# Altium project Mainboard.PrjPcb (part 1 of 2)
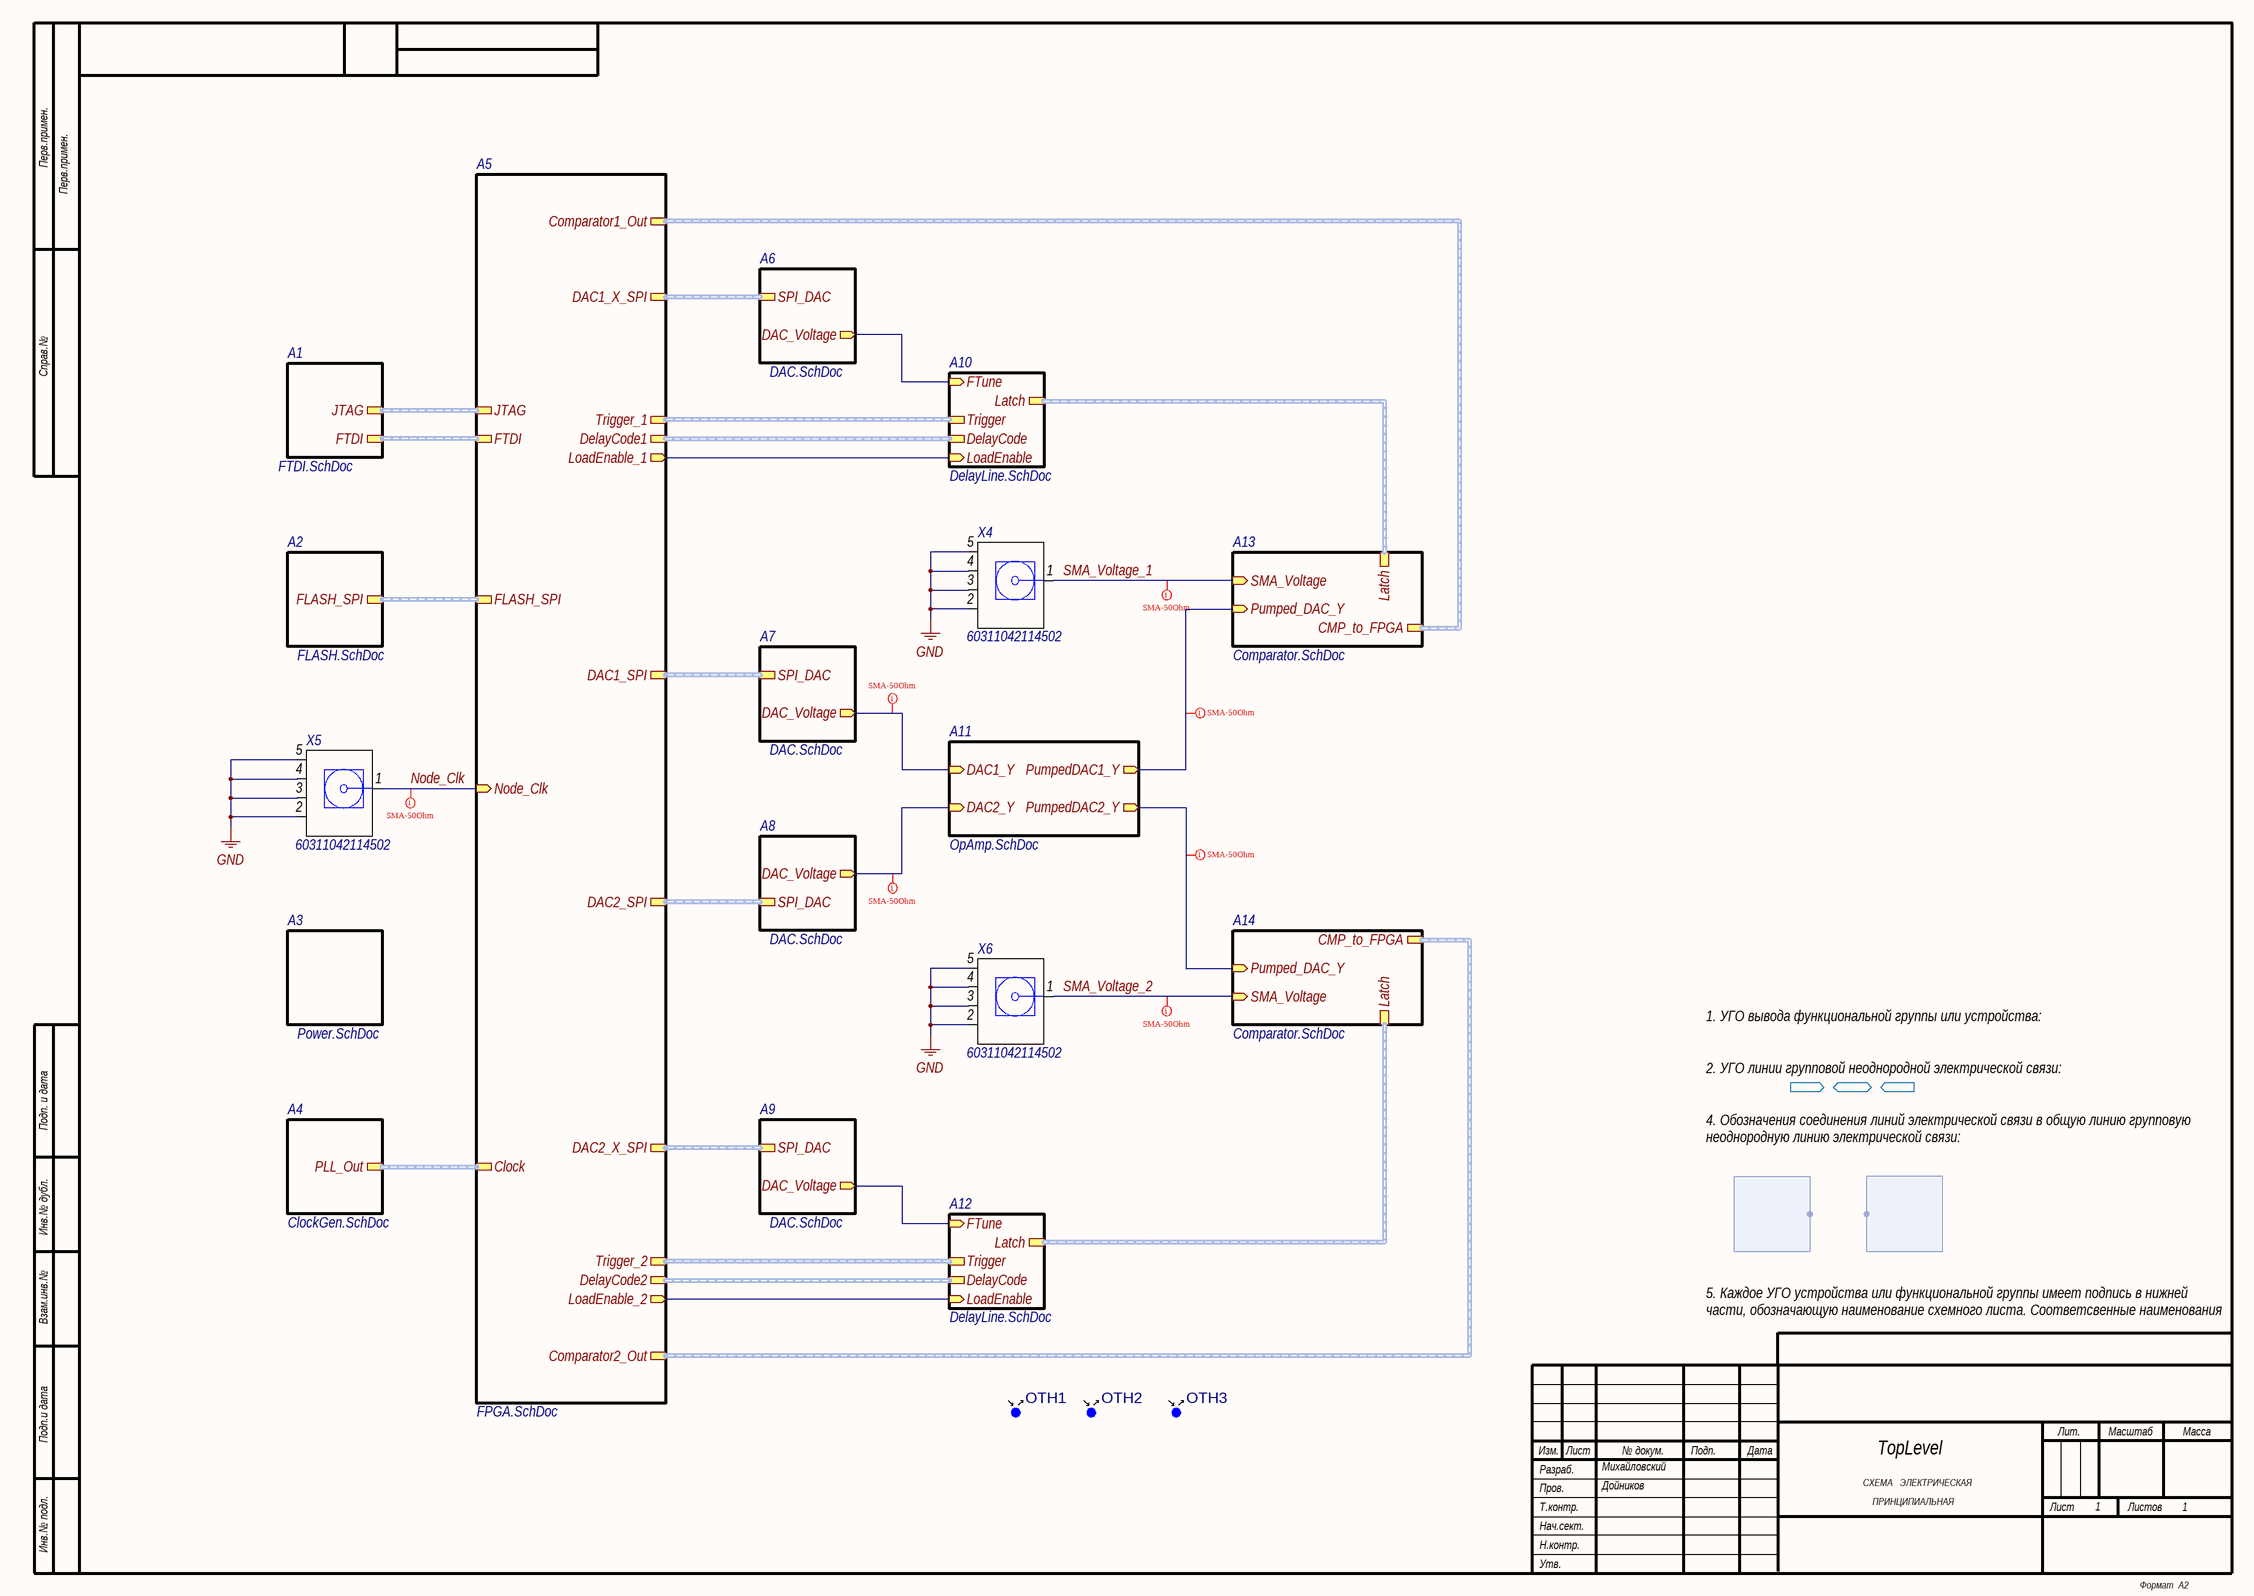
[diagram p0: TopLevel.SchDoc]
10 sheets, 208 parts. Net scope: hierarchical (ports join the sheet entries above them; power ports are global).
Board file: CalibratorPCB_v2.PcbDoc
Sheets:
  TopLevel.SchDoc
    A5 = FPGA.SchDoc
    A2 = FLASH.SchDoc
    A7 = DAC.SchDoc
    A1 = FTDI.SchDoc
    A3 = Power.SchDoc
    A13 = Comparator.SchDoc
    A10 = DelayLine.SchDoc
    A8 = DAC.SchDoc
    A12 = DelayLine.SchDoc
    A14 = Comparator.SchDoc
    A6 = DAC.SchDoc
    A9 = DAC.SchDoc
    A11 = OpAmp.SchDoc
    A4 = ClockGen.SchDoc

## Sheet TopLevel.SchDoc: Наименование
size 594 x 420 mm; CheckedBy: Дойников; Author: Михайловский; SheetNumber: 1; SheetTotal: 1; PageSetup: Record=PageOptions|CenterHorizontal=True|CenterVertical=True|PrintScale=0.94|XCorrection=1.00|YCorrection=1.00|PrintKind=1|BorderSize=5000000|LeftOffset=0|BottomOffset=0|Orientation=1|PaperLength=1000|PaperWidth=1000|Scale=100|PaperSource=7|PrintQuality=-4|MediaType=1|DitherType=10|PaperKind=A4|PrintScaleMode=1; MainDevice: Перв.примен.; Name: TopLevel; DocumentName: Sheet1.SCHDOC

### Parts
OTH1  REPER_D1.0MM  [REPER_D1.0MM]  (value not drawn)  (no BOM)
OTH2  REPER_D1.0MM  [REPER_D1.0MM]  (value not drawn)  (no BOM)
OTH3  REPER_D1.0MM  [REPER_D1.0MM]  (value not drawn)  (no BOM)
X4  (no value)  [60311042114502]
X5  (no value)  [60311042114502]
X6  (no value)  [60311042114502]

### Sub-sheets
A1 = FTDI.SchDoc: JTAG (harness JTAG), FTDI (harness FTDI_UART_SPI)
A2 = FLASH.SchDoc: FLASH_SPI (harness SPI)
A3 = Power.SchDoc: no entries
A4 = ClockGen.SchDoc: PLL_Out (harness Diff_Pair)
A5 = FPGA.SchDoc: JTAG (harness JTAG), FLASH_SPI (harness SPI), Trigger_1 (harness Signal), Trigger_2 (harness Signal), DAC2_SPI (harness SPI), DAC1_SPI (harness SPI), DelayCode1 (harness DelayCode), DelayCode2 (harness DelayCode), Comparator2_Out (harness Signal), Comparator1_Out (harness Signal), LoadEnable_2 (out), LoadEnable_1 (out), FTDI (harness FTDI_UART_SPI), DAC2_X_SPI (harness SPI), DAC1_X_SPI (harness SPI), Node_Clk (in), Clock (harness Diff_Pair)
A6 = DAC.SchDoc: SPI_DAC (harness SPI), DAC_Voltage (out)
A7 = DAC.SchDoc: SPI_DAC (harness SPI), DAC_Voltage (out)
A8 = DAC.SchDoc: SPI_DAC (harness SPI), DAC_Voltage (out)
A9 = DAC.SchDoc: SPI_DAC (harness SPI), DAC_Voltage (out)
A10 = DelayLine.SchDoc: Trigger (harness Signal), Latch (harness Signal), DelayCode (harness DelayCode), LoadEnable (in), FTune (in)
A11 = OpAmp.SchDoc: PumpedDAC2_Y (out), DAC1_Y (in), DAC2_Y (in), PumpedDAC1_Y (out)
A12 = DelayLine.SchDoc: Trigger (harness Signal), Latch (harness Signal), DelayCode (harness DelayCode), LoadEnable (in), FTune (in)
A13 = Comparator.SchDoc: Latch (harness Signal), CMP_to_FPGA (harness Signal), Pumped_DAC_Y (in), SMA_Voltage (in)
A14 = Comparator.SchDoc: Latch (harness Signal), CMP_to_FPGA (harness Signal), Pumped_DAC_Y (in), SMA_Voltage (in)

### Harnesses
*: 

### Nets
GND: X4.2(GND) X4.3(GND) X4.4(GND) X4.5(GND) X5.2(GND) X5.3(GND) X5.4(GND) X5.5(GND) X6.2(GND) X6.3(GND) X6.4(GND) X6.5(GND)
Enable_1: sheet A5/LoadEnable_1, sheet A10/LoadEnable
Enable_2: sheet A5/LoadEnable_2, sheet A12/LoadEnable
Node_Clk: X5.1(Signal) ; sheet A5/Node_Clk
SMA_Voltage_1: X4.1(Signal) ; sheet A13/SMA_Voltage
SMA_Voltage_2: X6.1(Signal) ; sheet A14/SMA_Voltage
NetA6.DA4_3: sheet A10/FTune, sheet A6/DAC_Voltage
NetA7.DA4_3: sheet A7/DAC_Voltage, sheet A11/DAC1_Y
NetA8.DA4_3: sheet A8/DAC_Voltage, sheet A11/DAC2_Y
NetA9.DA4_3: sheet A12/FTune, sheet A9/DAC_Voltage
NetA13.C55_1: sheet A13/Pumped_DAC_Y, sheet A11/PumpedDAC1_Y
NetA14.C55_1: sheet A14/Pumped_DAC_Y, sheet A11/PumpedDAC2_Y

### Buses and harness runs
harness sheet A1/FTDI = sheet A5/FTDI
harness sheet A1/JTAG = sheet A5/JTAG
harness sheet A2/FLASH_SPI = sheet A5/FLASH_SPI
harness sheet A4/PLL_Out = sheet A5/Clock
harness sheet A5/Comparator1_Out = sheet A13/CMP_to_FPGA
harness sheet A5/Comparator2_Out = sheet A14/CMP_to_FPGA
harness sheet A5/DAC1_SPI = sheet A7/SPI_DAC
harness sheet A5/DAC1_X_SPI = sheet A6/SPI_DAC
harness sheet A5/DAC2_SPI = sheet A8/SPI_DAC
harness sheet A5/DAC2_X_SPI = sheet A9/SPI_DAC
harness sheet A5/DelayCode1 = sheet A10/DelayCode
harness sheet A5/DelayCode2 = sheet A12/DelayCode
harness sheet A5/Trigger_1 = sheet A10/Trigger
harness sheet A5/Trigger_2 = sheet A12/Trigger
harness sheet A10/Latch = sheet A13/Latch
harness sheet A12/Latch = sheet A14/Latch

### Layout directives
net class Channel_SMA: NetA7.DA4_3, NetA8.DA4_3, NetA13.C55_1, NetA14.C55_1, Node_Clk, SMA_Voltage_1, SMA_Voltage_2

### Notes on the sheet
- 1. УГО вывода функциональной группы или устройства:
  2. УГО линии групповой неоднородной электрической связи:
  4. Обозначения соединения линий электрической связи в общую линию групповую неоднородную линию электрической связи:
  5. Каждое УГО устройства или функциональной группы имеет подпись в нижней части, обозначающую наименование схемного листа. Соответсвенные наименования схемных листов приведены на нижнем поле каждого листа.
  6. УГО экземпляров функциональных групп выполнены сплошной линией.
- Перв.примен.
- Справ.№
- Подп. и дата
- Инв.№ дубл.
- Взам.инв.№
- Подп.и дата
- Разраб.
- Изм.
- Лист
- № докум.
- Подп.
- Дата
- Лит.
- Масштаб
- Масса
- Т.контр.
- Пров.
- ПРИНЦИПИАЛЬНАЯ
- СХЕМА   ЭЛЕКТРИЧЕСКАЯ
- Листов
- Инв.№ подл.
- Утв.
- Н.контр.
- Нач.сект.
- Формат  A2

### Library data of the parts
OTH1-OTH3 = REPER_D1.0MM: MntType: SMD; MSL: MSL 1; RoHS: Comply; BOMDescription: SMD; CFootprint: =Footprint; PART NUMBER: REPER_D1.0MM; CLASSNAME: Reper; COMPONENTLINK1DESCRIPTION: Datasheet; BOMDESCRIPTIONRUS: =PartTypeRUS+' '+MPN
X4-X6 = SMA_WR_60311042114502: MANUFACTURER: WE; MNTTYPE: SMD; PART NUMBER: SMA_WR_60311042114502; MPN: 60311042114502; MSL: MSL 1; ROHS: Comply; PARTTYPE: SMA; PINS: 5; BOMDESCRIPTION: =MntType+' '+PartType+' '+Package+' '+Value+' '+Tolerance+' '+Voltage+' '+TempCoeff+' '+MPN; CFOOTPRINT: =Footprint; CLASSNAME: SMA; COMPONENTLINK1DESCRIPTION: Datasheet; COMPONENTLINK1URL: https://katalog.we-online.de/em/datasheet/60311042114502.pdf

## Sheet FPGA.SchDoc: Наименование
size 594 x 420 mm; Name1: мониторинга климатических; Name2: параметров СХД; ApprovedBy: Утвердил; CheckedBy: Проверил; Author: Разработал; CompanyName: Организация; DrawnBy: Н.Контр; Engineer: Т.Контр; SheetNumber: 1; SheetTotal: 1; PageSetup: Record=PageOptions|CenterHorizontal=True|CenterVertical=True|PrintScale=0.94|XCorrection=1.00|YCorrection=1.00|PrintKind=1|BorderSize=5000000|LeftOffset=0|BottomOffset=0|Orientation=1|PaperLength=1000|PaperWidth=1000|Scale=100|PaperSource=7|PrintQuality=-4|MediaType=1|DitherType=10|PaperKind=A4|PrintScaleMode=1; DecimalNumber: FPGA; HeadOfSector: Нач. сектора; MainDevice: Перв.примен.; Name: Наименование; DocumentName: Sheet1.SCHDOC
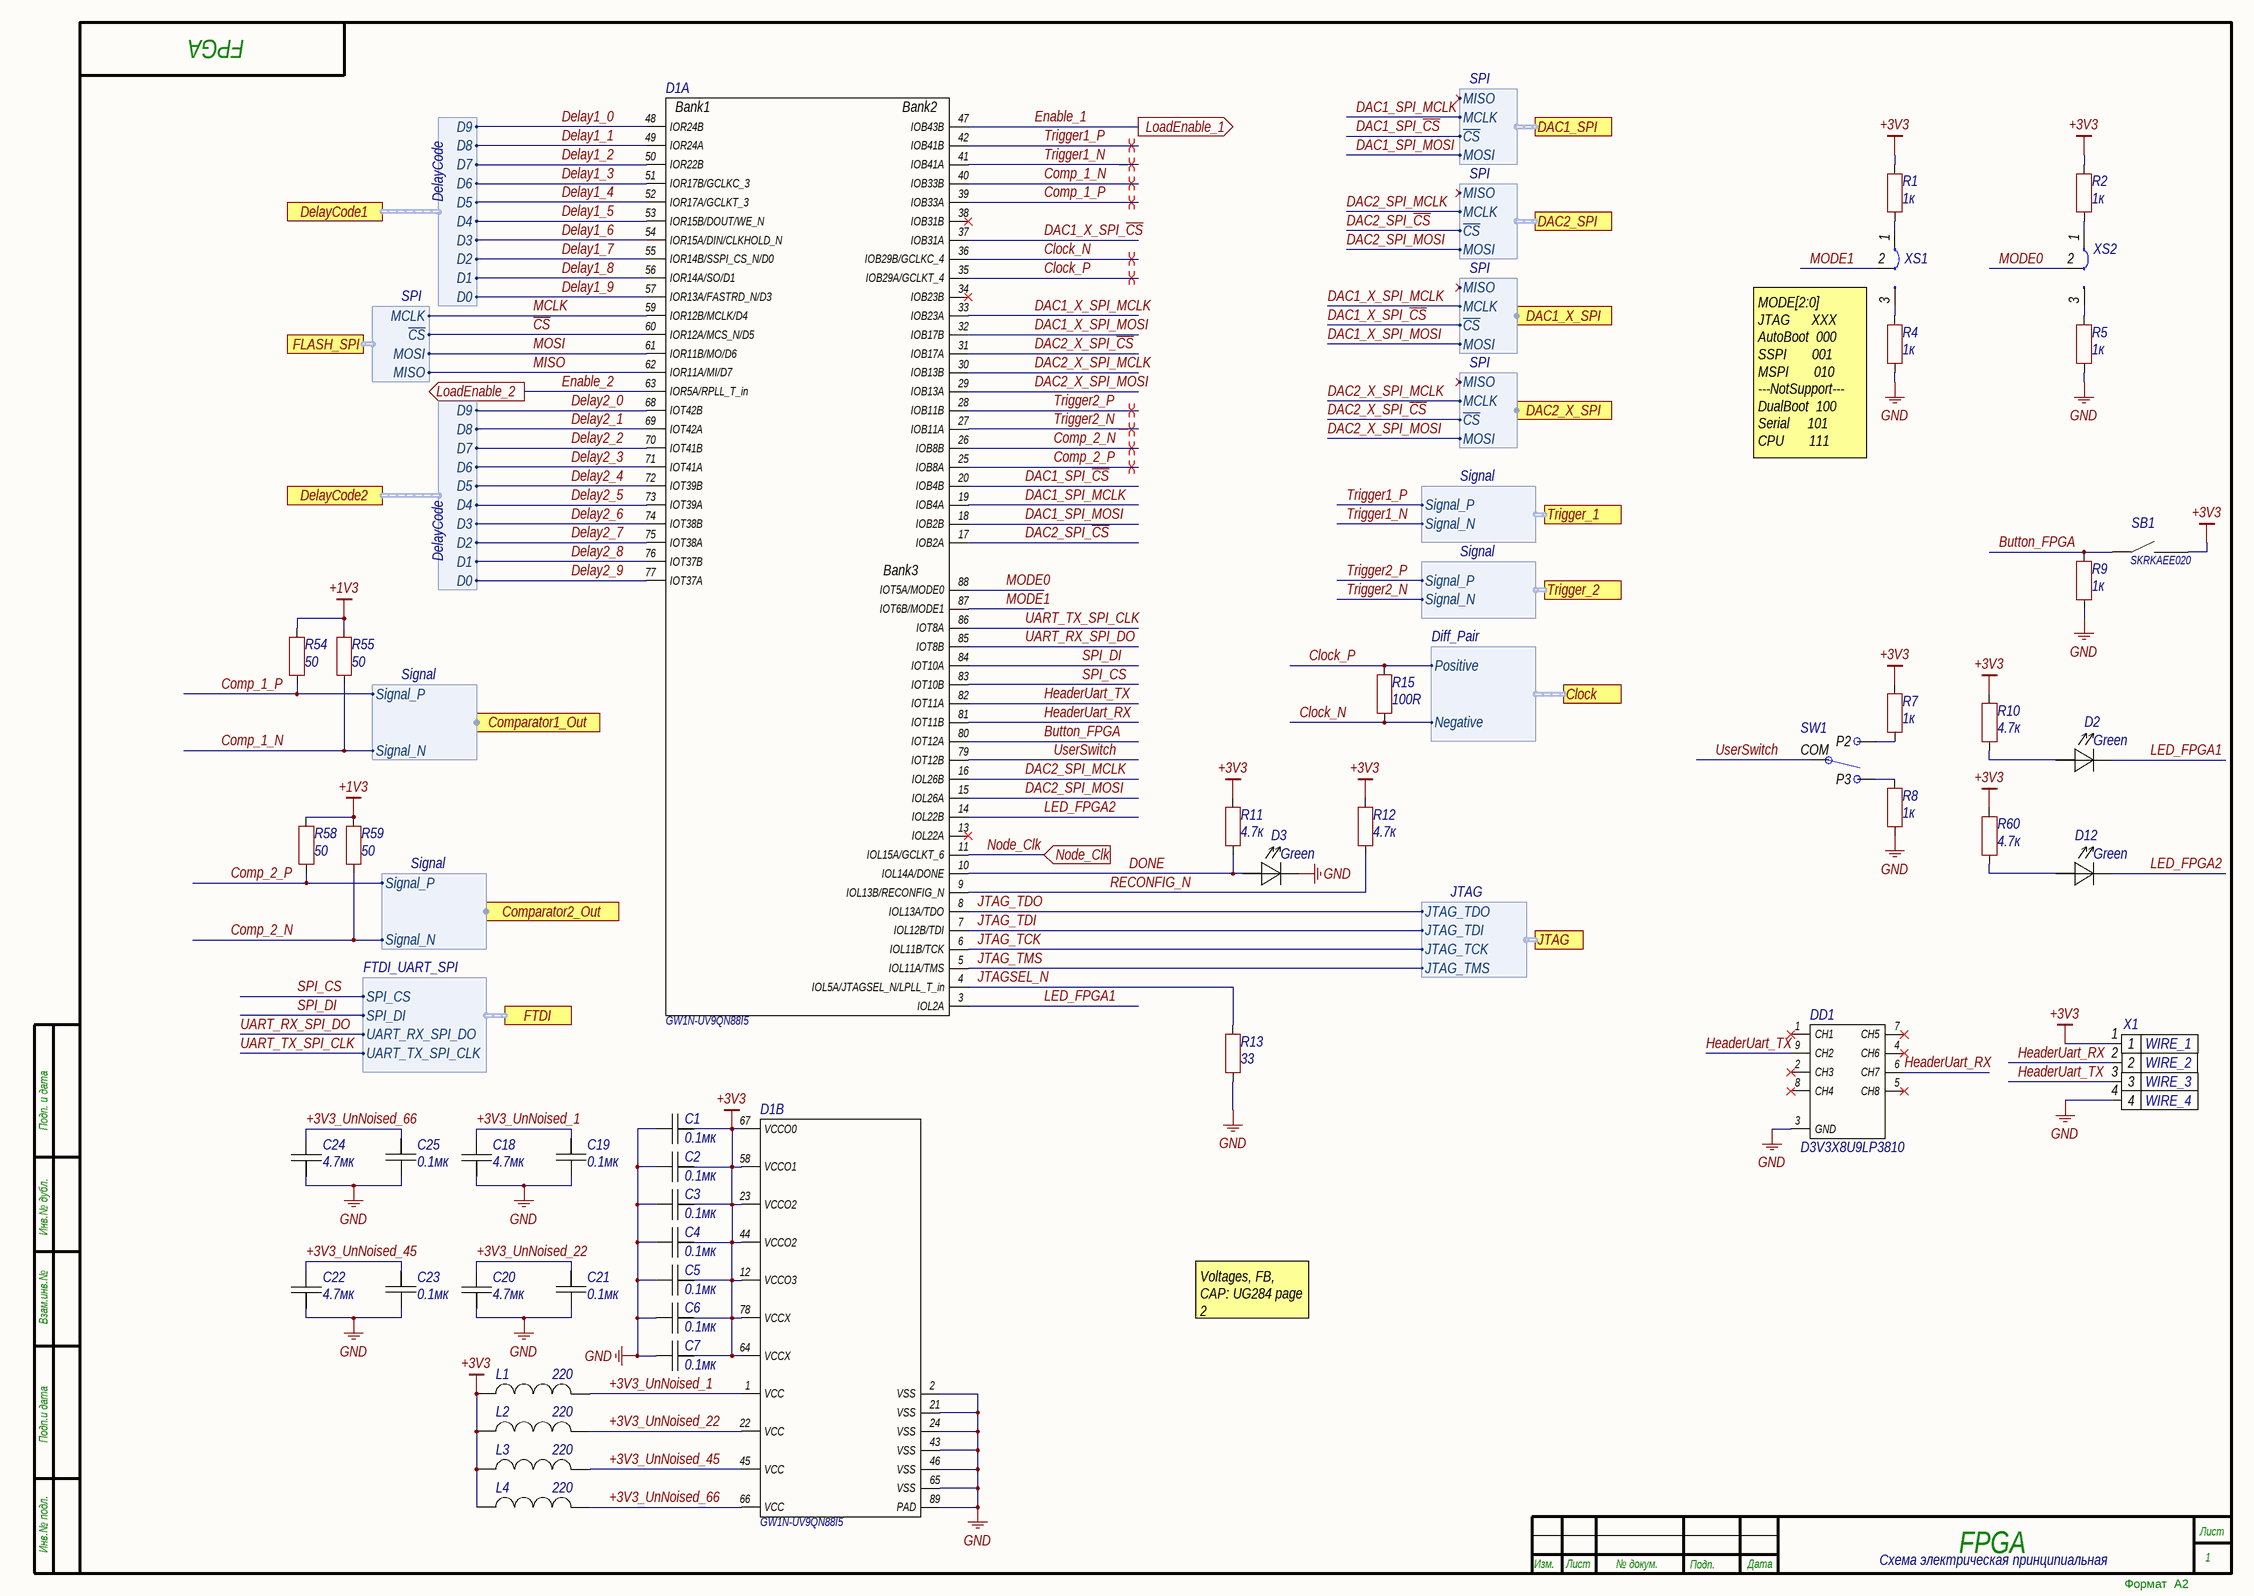
[diagram p1: FPGA.SchDoc]

### Parts
C1  value 0.1мк  [CAP0402]  (hidden comment: 0.1мк 50V)
C2  value 0.1мк  [CAP0402]  (hidden comment: 0.1мк 50V)
C3  value 0.1мк  [CAP0402]  (hidden comment: 0.1мк 50V)
C4  value 0.1мк  [CAP0402]  (hidden comment: 0.1мк 50V)
C5  value 0.1мк  [CAP0402]  (hidden comment: 0.1мк 50V)
C6  value 0.1мк  [CAP0402]  (hidden comment: 0.1мк 50V)
C7  value 0.1мк  [CAP0402]  (hidden comment: 0.1мк 50V)
C18  value 4.7мк  [CAP0402]  (hidden comment: 4.7мк 10V)
C19  value 0.1мк  [CAP0402]  (hidden comment: 0.1мк 50V)
C20  value 4.7мк  [CAP0402]  (hidden comment: 4.7мк 10V)
C21  value 0.1мк  [CAP0402]  (hidden comment: 0.1мк 50V)
C22  value 4.7мк  [CAP0402]  (hidden comment: 4.7мк 10V)
C23  value 0.1мк  [CAP0402]  (hidden comment: 0.1мк 50V)
C24  value 4.7мк  [CAP0402]  (hidden comment: 4.7мк 10V)
C25  value 0.1мк  [CAP0402]  (hidden comment: 0.1мк 50V)
D1  MPN: GW1N-UV9QN88I5  [QFN88_0.4pitch]  (parts A,B of 2)
D2  Green  [LED603]
D3  Green  [LED603]
D12  Green  [LED603]
DD1  MPN: D3V3X8U9LP3810  [U-DFN3810-9]  (hidden comment: TVS Diode at JTAG)
L1  220  [CAPC0603N]
L2  220  [CAPC0603N]
L3  220  [CAPC0603N]
L4  220  [CAPC0603N]
R1  value 1к  [RESC0402(1005)_M]  (hidden comment: 1к 1/16W)
R2  value 1к  [RESC0402(1005)_M]  (hidden comment: 1к 1/16W)
R4  value 1к  [RESC0402(1005)_M]  (hidden comment: 1к 1/16W)
R5  value 1к  [RESC0402(1005)_M]  (hidden comment: 1к 1/16W)
R7  value 1к  [RESC0402(1005)_M]  (hidden comment: 1к 1/16W)
R8  value 1к  [RESC0402(1005)_M]  (hidden comment: 1к 1/16W)
R9  1к  [RESC0402(1005)_M]
R10  4.7к  [RESC0402(1005)_M]
R11  4.7к  [RESC0402(1005)_M]
R12  4.7к  [RESC0402(1005)_M]
R13  value 33  [RESC0402(1005)_M]  (hidden comment: 33 1/16W)
R15  100R  [RESC0402(1005)_M]
R54  50  [RESC0402(1005)_M]
R55  50  [RESC0402(1005)_M]
R58  50  [RESC0402(1005)_M]
R59  50  [RESC0402(1005)_M]
R60  4.7к  [RESC0402(1005)_M]
SB1  MPN: SKRKAEE020  [SW_SKRKAEE020]  (hidden comment: DTSM-3)
SW1  Slide Switch  [KLS7-SS03-12D02-EG-3.0]  (value not drawn)
X1  Wire1: WIRE_1  Wire2: WIRE_2  Wire3: WIRE_3  Wire4: WIRE_4  [PLS4]  (hidden comment: PLS4)
XS1  PLS3  [PLS3]  (value not drawn)  (no BOM)
XS2  PLS3  [PLS3]  (value not drawn)  (no BOM)

### Ports
Clock (harness Diff_Pair), Comparator1_Out (harness Signal), Comparator2_Out (harness Signal), DAC1_SPI (harness SPI), DAC1_X_SPI (harness SPI), DAC2_SPI (harness SPI), DAC2_X_SPI (harness SPI), DelayCode1 (harness DelayCode), DelayCode2 (harness DelayCode), FLASH_SPI (harness SPI), FTDI (harness FTDI_UART_SPI), JTAG (harness JTAG), LoadEnable_1 (out), LoadEnable_2 (out), Node_Clk (in), Trigger_1 (harness Signal), Trigger_2 (harness Signal)

### Harnesses
JTAG: JTAG_TCK, JTAG_TDI, JTAG_TDO, JTAG_TMS
SPI: ~{CS}, MCLK, MISO, MOSI
Signal: Signal_P, Signal_N
DelayCode: D0, D1, D2, D3, D4, D5, D6, D7, D8, D9
FTDI_UART_SPI: SPI_CS, SPI_DI, UART_RX_SPI_DO, UART_TX_SPI_CLK
Diff_Pair: Positive, Negative

### Nets
+1V3: R54.2 R55.2 R58.2 R59.2
+3V3: C1.1 C2.1 C3.1 C4.1 C5.1 C6.1 C7.1 D1.12(VCCO3) D1.23(VCCO2) D1.44(VCCO2) D1.58(VCCO1) D1.64(VCCX) D1.67(VCCO0) D1.78(VCCX) L1.1 L2.1 L3.1 L4.1 R1.2 R2.2 R7.2 R10.2 R11.2 R12.2 R60.2 SB1.1 X1.1
GND: C1.2 C2.2 C3.2 C4.2 C5.2 C6.2 C7.2 C18.1 C19.2 C20.1 C21.2 C22.1 C23.2 C24.1 C25.2 D1.2(VSS) D1.21(VSS) D1.24(VSS) D1.43(VSS) D1.46(VSS) D1.65(VSS) D1.89(PAD) D3.1(A) DD1.3(GND) R4.1 R5.1 R8.1 R9.1 R13.1 X1.4
+3V3_UnNoised_1: C18.2 C19.1 D1.1(VCC) L1.2
+3V3_UnNoised_22: C20.2 C21.1 D1.22(VCC) L2.2
+3V3_UnNoised_45: C22.2 C23.1 D1.45(VCC) L3.2
+3V3_UnNoised_66: C24.2 C25.1 D1.66(VCC) L4.2
~{CS}: D1.60(IOR12A/MCS_N/D5) ; port FLASH_SPI.~{CS}
Button_FPGA: D1.80(IOT12A) R9.2 SB1.2
Clock_N: D1.36(IOB29B/GCLKC_4) R15.1 ; port Clock.Negative
Clock_P: D1.35(IOB29A/GCLKT_4) R15.2 ; port Clock.Positive
Comp_1_N: D1.40(IOB33B) R55.1 ; port Comparator1_Out.Signal_N
Comp_1_P: D1.39(IOB33A) R54.1 ; port Comparator1_Out.Signal_P
Comp_2_N: D1.26(IOB8B) R59.1 ; port Comparator2_Out.Signal_N
Comp_2_P: D1.25(IOB8A) R58.1 ; port Comparator2_Out.Signal_P
DAC1_SPI_~{CS}: D1.20(IOB4B) ; port DAC1_SPI.~{CS}
DAC1_SPI_MCLK: D1.19(IOB4A) ; port DAC1_SPI.MCLK
DAC1_SPI_MOSI: D1.18(IOB2B) ; port DAC1_SPI.MOSI
DAC1_X_SPI_~{CS}: D1.37(IOB31A) ; port DAC1_X_SPI.~{CS}
DAC1_X_SPI_MCLK: D1.33(IOB23A) ; port DAC1_X_SPI.MCLK
DAC1_X_SPI_MOSI: D1.32(IOB17B) ; port DAC1_X_SPI.MOSI
DAC2_SPI_~{CS}: D1.17(IOB2A) ; port DAC2_SPI.~{CS}
DAC2_SPI_MCLK: D1.16(IOL26B) ; port DAC2_SPI.MCLK
DAC2_SPI_MOSI: D1.15(IOL26A) ; port DAC2_SPI.MOSI
DAC2_X_SPI_~{CS}: D1.31(IOB17A) ; port DAC2_X_SPI.~{CS}
DAC2_X_SPI_MCLK: D1.30(IOB13B) ; port DAC2_X_SPI.MCLK
DAC2_X_SPI_MOSI: D1.29(IOB13A) ; port DAC2_X_SPI.MOSI
Delay1_0: D1.48(IOR24B) ; port DelayCode1.D9
Delay1_1: D1.49(IOR24A) ; port DelayCode1.D8
Delay1_2: D1.50(IOR22B) ; port DelayCode1.D7
Delay1_3: D1.51(IOR17B/GCLKC_3) ; port DelayCode1.D6
Delay1_4: D1.52(IOR17A/GCLKT_3) ; port DelayCode1.D5
Delay1_5: D1.53(IOR15B/DOUT/WE_N) ; port DelayCode1.D4
Delay1_6: D1.54(IOR15A/DIN/CLKHOLD_N) ; port DelayCode1.D3
Delay1_7: D1.55(IOR14B/SSPI_CS_N/D0) ; port DelayCode1.D2
Delay1_8: D1.56(IOR14A/SO/D1) ; port DelayCode1.D1
Delay1_9: D1.57(IOR13A/FASTRD_N/D3) ; port DelayCode1.D0
Delay2_0: D1.68(IOT42B) ; port DelayCode2.D9
Delay2_1: D1.69(IOT42A) ; port DelayCode2.D8
Delay2_2: D1.70(IOT41B) ; port DelayCode2.D7
Delay2_3: D1.71(IOT41A) ; port DelayCode2.D6
Delay2_4: D1.72(IOT39B) ; port DelayCode2.D5
Delay2_5: D1.73(IOT39A) ; port DelayCode2.D4
Delay2_6: D1.74(IOT38B) ; port DelayCode2.D3
Delay2_7: D1.75(IOT38A) ; port DelayCode2.D2
Delay2_8: D1.76(IOT37B) ; port DelayCode2.D1
Delay2_9: D1.77(IOT37A) ; port DelayCode2.D0
DONE: D1.10(IOL14A/DONE) D3.2(K) R11.1
Enable_1: D1.47(IOB43B) ; port LoadEnable_1
Enable_2: D1.63(IOR5A/RPLL_T_in) ; port LoadEnable_2
HeaderUart_RX: D1.81(IOT11B) DD1.6(CH7) X1.2
HeaderUart_TX: D1.82(IOT11A) DD1.9(CH2) X1.3
JTAG_TCK: D1.6(IOL11B/TCK) ; port JTAG.JTAG_TCK
JTAG_TDI: D1.7(IOL12B/TDI) ; port JTAG.JTAG_TDI
JTAG_TDO: D1.8(IOL13A/TDO) ; port JTAG.JTAG_TDO
JTAG_TMS: D1.5(IOL11A/TMS) ; port JTAG.JTAG_TMS
JTAGSEL_N: D1.4(IOL5A/JTAGSEL_N/LPLL_T_in) R13.2
LED_FPGA1: D1.3(IOL2A) D2.1(A)
LED_FPGA2: D1.14(IOL22B) D12.1(A)
MCLK: D1.59(IOR12B/MCLK/D4) ; port FLASH_SPI.MCLK
MISO: D1.62(IOR11A/MI/D7) ; port FLASH_SPI.MISO
MODE0: D1.88(IOT5A/MODE0) XS2.2
MODE1: D1.87(IOT6B/MODE1) XS1.2
MOSI: D1.61(IOR11B/MO/D6) ; port FLASH_SPI.MOSI
Node_Clk: D1.11(IOL15A/GCLKT_6) ; port Node_Clk
RECONFIG_N: D1.9(IOL13B/RECONFIG_N) R12.1
SPI_CS: D1.83(IOT10B) ; port FTDI.SPI_CS
SPI_DI: D1.84(IOT10A) ; port FTDI.SPI_DI
Trigger1_N: D1.41(IOB41A) ; port Trigger_1.Signal_N
Trigger1_P: D1.42(IOB41B) ; port Trigger_1.Signal_P
Trigger2_N: D1.27(IOB11A) ; port Trigger_2.Signal_N
Trigger2_P: D1.28(IOB11B) ; port Trigger_2.Signal_P
UART_RX_SPI_DO: D1.85(IOT8B) ; port FTDI.UART_RX_SPI_DO
UART_TX_SPI_CLK: D1.86(IOT8A) ; port FTDI.UART_TX_SPI_CLK
UserSwitch: D1.79(IOT12B) SW1.2(COM)
NetD2_2: D2.2(K) R10.1
NetD12_2: D12.2(K) R60.1
NetR1_1: R1.1 XS1.1
NetR2_1: R2.1 XS2.1
NetR4_2: R4.2 XS1.3
NetR5_2: R5.2 XS2.3
NetR7_1: R7.1 SW1.1(P2)
NetR8_2: R8.2 SW1.3(P3)

Not connected (* = marked no-connect by the designer): D1 13(IOL22A)* 34(IOB23B)* 38(IOB31B)*; DD1 1(CH1)* 2(CH3)* 4(CH6)* 5(CH8)* 7(CH5)* 8(CH4)*

### Layout directives
differential pair; differential pair class LVDS/PECL: Clock_N, Clock_P, Comp_1_N, Comp_1_P, Comp_2_N, Comp_2_P, Trigger1_N, Trigger1_P, Trigger2_N, Trigger2_P

### Notes on the sheet
- MODE[2:0]
  JTAG      XXX
  AutoBoot  000
  SSPI       001
  MSPI       010
  ---NotSupport---
  DualBoot  100
  Serial     101
  CPU       111
- Voltages, FB, CAP: UG284 page 2
- Схема электрическая принципиальная
- Подп. и дата
- Инв.№ дубл.
- Взам.инв.№
- Подп.и дата
- Инв.№ подл.
- Изм.
- Лист
- № докум.
- Подп.
- Дата
- Формат  A2
- (in symbol GW1N-UV9QN88I5, part A) Bank1; Bank2; Bank3

### Library data of the parts
C1-C7 C19 C21 C23 C25 = CAP0402: Manufacturer: Samsung Electro-Mechanics; ManufacturerAlt: JLCPCB; MPN: CL05B104KB54PNC; MPNAlt: C307331; MntType: SMD; Notes: Basic Part; Tolerance: 10%; Height: 0.5mm; MSL: MSL 1; Package: =Footprint; RoHS: Comply; Weight: 1.500mg; PartType: CHIP CERAMIC CAPACITOR; Pins: 2; BOMDescription: =MntType+' '+PartType+' '+Package+' '+Value+' '+Tolerance+' '+Voltage+' '+TempCoeff+' '+MPN; CFootprint: =Footprint; Voltage: 50V; Part Number: CAP0402; ClassName: Capacitor; ComponentLink1Description: Datasheet; ComponentLink1Description: New link; ComponentLink1URL: https://datasheet.lcsc.com/lcsc/1810191222_Samsung-Electro-Mechanics-CL05B104KB54PNC_C307331.pdf
C18 C20 C22 C24 = CAP0402: Manufacturer: Samsung Electro-Mechanics; ManufacturerAlt: JLCPCB; MPN: CL05A475MP5NRNC; MPNAlt: C23733; MntType: SMD; Tolerance: 20%; Height: 0.5mm; MSL: MSL 1; Package: =Footprint; RoHS: Comply; Weight: 1.500mg; PartType: CHIP CERAMIC CAPACITOR; Pins: 2; BOMDescription: =MntType+' '+PartType+' '+Package+' '+Value+' '+Tolerance+' '+Voltage+' '+TempCoeff+' '+MPN; CFootprint: =Footprint; Voltage: 10V; Part Number: CAP0402; ClassName: Capacitor; ComponentLink1Description: Datasheet; ComponentLink1Description: New link; ComponentLink1URL: https://datasheet.lcsc.com/lcsc/1810191211_Samsung-Electro-Mechanics-CL05A475MP5NRNC_C23733.pdf
D1 = GW1N-UV9QN88I5: Manufacturer: GoWin; MntType: SMD; Part Number: GW1N-UV9QN88I5; MSL: MSL 1; Package: QFN88; RoHS: Comply; PartType: FPGA; Pins: 88; BOMDescription: GW1N-UV9QN88I5; CFootprint: =Footprint; ClassName: FPGA; ComponentLink1Description: Datasheet; ComponentLink1URL: https://www.gowinsemi.com/en/support/database/?support_search=DS100
D2 D3 = LEDC: Manufacturer: Everlight Elec; ManufacturerAlt: JLCPCB; MPN: 19-217/GHC-YR1S2/3T; MPNAlt: C72043; MntType: SMD; MSL: MSL 5; Package: =Footprint; RoHS: Comply; PartType: CHIP LED; Pins: 2; BOMDescription: =MntType+' '+PartType+' '+Package+' '+Value+' '+Tolerance+' '+Voltage+' '+TempCoeff+' '+MPN; CFootprint: =Footprint; Value: Green; Part Number: LEDC; ClassName: LED; ComponentLink1Description: Datasheet
D12 = LEDC: MntType: SMD; MSL: MSL 5; Package: =Footprint; RoHS: Comply; PartType: CHIP LED; Pins: 2; BOMDescription: =MntType+' '+PartType+' '+Package+' '+Value+' '+Tolerance+' '+Voltage+' '+TempCoeff+' '+MPN; CFootprint: =Footprint; Value: Green; PART NUMBER: LEDC; CLASSNAME: LED; COMPONENTLINK1DESCRIPTION: Datasheet
DD1 = D3V3X8U9LP3810: Manufacturer: DiodesInc; MntType: SMD; Part Number: D3V3X8U9LP3810; MSL: MSL 1; Package: =Footprint; RoHS: Comply; PartType: TVS; Pins: 9; BOMDescription: D3V3X8U9LP3810; CFootprint: =Footprint; ClassName: TVS; ComponentLink1Description: Datasheet; ComponentLink1URL: https://www.diodes.com/assets/Datasheets/D3V3X8U9LP3810.pdf
L1-L4 = BLM18KG221SN1D: Manufacturer: Murata Electronics; ManufacturerAlt: JLCPCB; MPNAlt: C88980; MntType: SMD; Tolerance: 25%; MPN: BLM18KG221SN1D; Height: 0.6mm; MSL: MSL 1; Package: =Footprint; RoHS: Comply; Weight: 5mg; PartType: Ferrite Beads; Pins: 2; BOMDescription: =MntType+' '+PartType+' '+Package+' '+Value+' '+Tolerance+' '+Voltage+' '+TempCoeff+' '+MPN; CFootprint: =Footprint; Value: 220; Part Number: BLM18KG221SN1D; ClassName: Ferrite Beads; ComponentLink1Description: Datasheet; ComponentLink1URL: https://ru.mouser.com/datasheet/2/281/ENFA0003-1915778.pdf
R1 R2 R4 R5 R7 R8 = RES0402: Manufacturer: UNI-ROYAL; ManufacturerAlt: JLCPCB; MPN: 0402WGF1001TCE; MPNAlt: C11702; MntType: SMD; TempCoeff: 100ppm/C; Tolerance: 1%; Voltage: 50V; Height: 0.35mm; MSL: MSL 1; Package: =Footprint; Power: 1/16W; RoHS: Comply; PartType: CHIP RESISTOR; Pins: 2; BOMDescription: =MntType+' '+PartType+' '+Package+' '+Value+' '+Tolerance+' '+Voltage+' '+TempCoeff+' '+MPN; CFootprint: =Footprint; Part Number: RES0402; ClassName: Resistor; ComponentLink1Description: Datasheet; ComponentLink1Description: New link; ComponentLink1URL: https://datasheet.lcsc.com/lcsc/1811132311_UNI-ROYAL-Uniroyal-Elec-0402WGF1001TCE_C11702.pdf
R9 R15 R54 R55 R58-R60 = RES0402: MntType: SMD; MSL: MSL 1; Package: =Footprint; RoHS: Comply; PartType: CHIP RESISTOR; Pins: 2; BOMDescription: =MntType+' '+PartType+' '+Package+' '+Value+' '+Tolerance+' '+Voltage+' '+TempCoeff+' '+MPN; CFootprint: =Footprint
  R9: Value: 1к; Part Number: RES0402; ClassName: Resistor; ComponentLink1Description: Datasheet
  R15: Value: 100R; Part Number: RES0402; ClassName: Resistor; ComponentLink1Description: Datasheet
  R54 R55 R58 R59: Value: 50; PART NUMBER: RES0402; CLASSNAME: Resistor; COMPONENTLINK1DESCRIPTION: Datasheet
  R60: Value: 4.7к; PART NUMBER: RES0402; CLASSNAME: Resistor; COMPONENTLINK1DESCRIPTION: Datasheet
R10-R12 = RES0402: Manufacturer: UNI-ROYAL; ManufacturerAlt: JLCPCB; MPN: 0402WGF4701TCE; MPNAlt: C25900; MntType: SMD; MSL: MSL 1; Package: =Footprint; RoHS: Comply; PartType: CHIP RESISTOR; Pins: 2; BOMDescription: =MntType+' '+PartType+' '+Package+' '+Value+' '+Tolerance+' '+Voltage+' '+TempCoeff+' '+MPN; CFootprint: =Footprint; Value: 4.7к; Part Number: RES0402; ClassName: Resistor; ComponentLink1Description: Datasheet
R13 = RES0402: Manufacturer: UNI-ROYAL; ManufacturerAlt: JLCPCB; MPN: 0402WGF330JTCE; MPNAlt: C25105; MntType: SMD; Notes: Basic Part; TempCoeff: 200ppm/C; Tolerance: 1%; Voltage: 50V; Height: 0.35mm; MSL: MSL 1; Package: =Footprint; Power: 1/16W; RoHS: Comply; PartType: CHIP RESISTOR; Pins: 2; BOMDescription: =MntType+' '+PartType+' '+Package+' '+Value+' '+Tolerance+' '+Voltage+' '+TempCoeff+' '+MPN; CFootprint: =Footprint; Part Number: RES0402; ClassName: Resistor; ComponentLink1Description: Datasheet; ComponentLink1Description: New link; ComponentLink1URL: https://datasheet.lcsc.com/lcsc/1810301314_UNI-ROYAL-Uniroyal-Elec-0402WGF330JTCE_C25105.pdf
SB1 = SKRKAEE020: MntType: SMD; Part Number: SKRKAEE020; MSL: MSL 1; RoHS: Comply; PartType: BUTTON; Pins: 2; BOMDescription: SKRKAEE020; CFootprint: =Footprint; ClassName: Button; ComponentLink1Description: Datasheet; ComponentLink1URL: https://datasheet.lcsc.com/lcsc/1809201020_ALPSALPINE-SKRKAEE020_C115357.pdf
SW1 = KLS7-SS03-12D02-EG-3.0: Toggle Switch SPDT Through Hole, Right Angle; MANUFACTURER: KLS Electronic; MNTTYPE: TH; MPN: KLS7-SS03-12D02-EG-3.0; PART NUMBER: KLS7-SS03-12D02-EG-3.0; MSL: MSL 1; PACKAGE: =Footprint; ROHS: Comply; PARTTYPE: Slide_Switch; PINS: 3; BOMDESCRIPTION: =MntType+' '+PartType+' '+Package+' '+Value+' '+Tolerance+' '+Voltage+' '+TempCoeff+' '+MPN; CFOOTPRINT: =Footprint; CLASSNAME: Switch; COMPONENTLINK1DESCRIPTION: Datasheet; COMPONENTLINK1URL: http://www.cnkls.com/admin/product_upload/20120515151849KLS7-SS03-12D02.pdf
X1 = PLS4: MntType: DIP; BOMDescription: DIP CONNECTOR CONNPLS4     PLS4; SYSTEM: Connector; MPN: PLS4; MSL: MSL 1; Package: CONNPLS4; RoHS: Comply; PartType: CONNECTOR; Pins: 4; CFootprint: =Footprint; PART NUMBER: PLS4; CLASSNAME: Connector; COMPONENTLINK1DESCRIPTION: Datasheet
XS1 XS2 = Jumper_PLS3: MNTTYPE: TH; State: *; PART NUMBER: Jumper_PLS3; MPN: PLS3; MSL: MSL 1; PACKAGE: =Footprint; ROHS: Comply; PARTTYPE: Jumper; PINS: 3; BOMDESCRIPTION: =MntType+' '+PartType+' '+Package+' '+Value+' '+Tolerance+' '+Voltage+' '+TempCoeff+' '+MPN; CFOOTPRINT: =Footprint; CLASSNAME: Jumper; COMPONENTLINK1DESCRIPTION: Datasheet; COMPONENTLINK1URL: https://static.chipdip.ru/lib/977/DOC005977245.pdf

## Sheet FLASH.SchDoc: Наименование
size 209 x 297 mm; ApprovedBy: Утвердил; CheckedBy: Проверил; Author: Разработал; CompanyName: Организация; DrawnBy: Н.Контр; Engineer: Т.Контр; SheetNumber: 1; SheetTotal: 1; PageSetup: Record=PageOptions|CenterHorizontal=True|CenterVertical=True|PrintScale=0.94|XCorrection=1.00|YCorrection=1.00|PrintKind=1|BorderSize=5000000|LeftOffset=0|BottomOffset=0|Orientation=1|PaperLength=1000|PaperWidth=1000|Scale=100|PaperSource=7|PrintQuality=-4|MediaType=1|DitherType=10|PaperKind=A4|PrintScaleMode=1; DecimalNumber: FLASH; HeadOfSector: Нач. сектора; MainDevice: Перв.примен.; Name: Наименование; DocumentName: Sheet1.SCHDOC
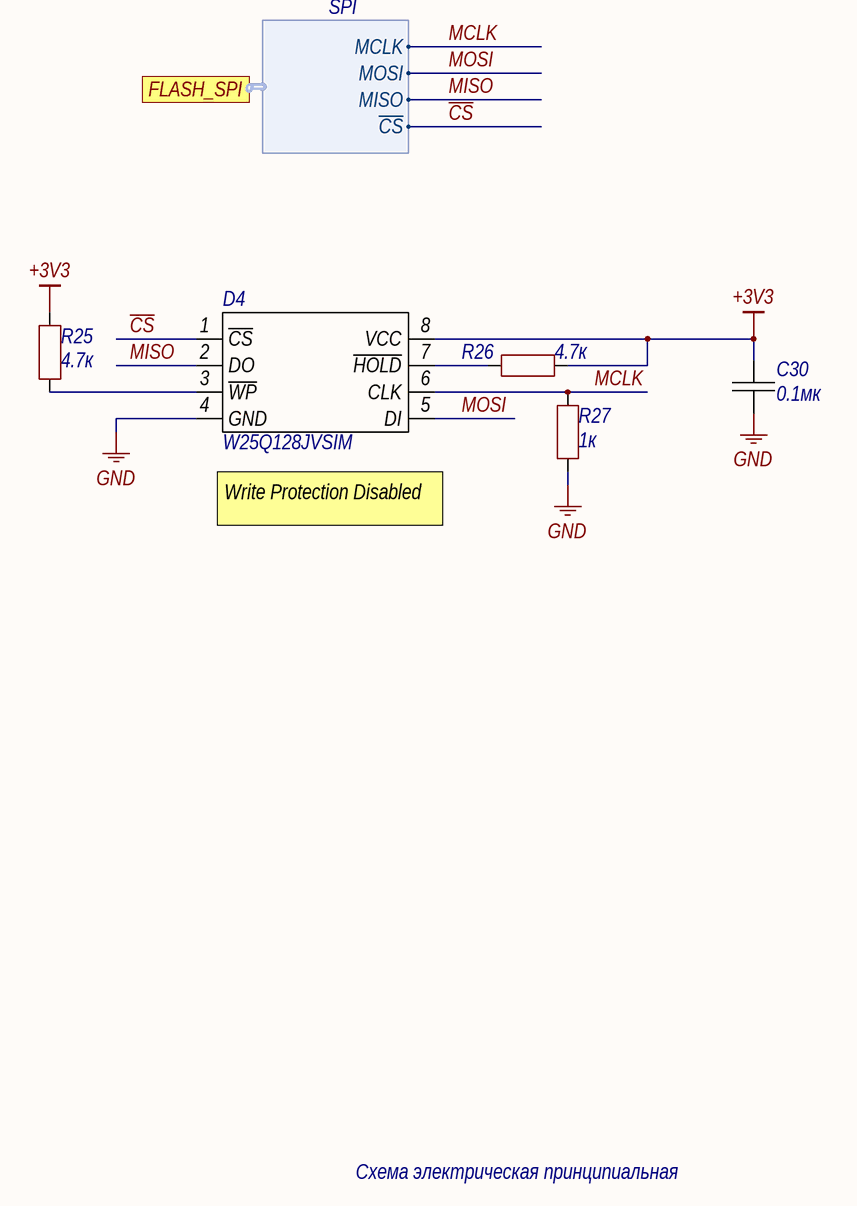
[diagram p2: FLASH.SchDoc]

### Parts
C30  value 0.1мк  [CAP0402]  (hidden comment: 0.1мк 50V)
D4  MPN: W25Q128JVSIM  [SOIC-8_208MIL_M]
R25  value 4.7к  [RESC0402(1005)_M]  (hidden comment: 4.7к 1/16W)
R26  value 4.7к  [RESC0402(1005)_M]  (hidden comment: 4.7к 1/16W)
R27  value 1к  [RESC0402(1005)_M]  (hidden comment: 1к 1/16W)

### Ports
FLASH_SPI (harness SPI)

### Harnesses
SPI: MCLK, MOSI, MISO, ~{CS}

### Nets
+3V3: C30.2 D4.8(VCC) R25.1 R26.1
GND: C30.1 D4.4(GND) R27.1
~{CS}: D4.1(~{CS}) ; port FLASH_SPI.~{CS}
MCLK: D4.6(CLK) R27.2 ; port FLASH_SPI.MCLK
MISO: D4.2(DO) ; port FLASH_SPI.MISO
MOSI: D4.5(DI) ; port FLASH_SPI.MOSI
NetD4_3: D4.3(~{WP}) R25.2
NetD4_7: D4.7(~{HOLD}) R26.2

### Notes on the sheet
- (near D4) Write Protection Disabled
- Схема электрическая принципиальная
- Подп. и дата
- Инв.№ дубл.
- Взам.инв.№
- Подп.и дата
- Инв.№ подл.
- Изм.
- Лист
- № докум.
- Подп.
- Дата
- Формат  A4

### Library data of the parts
C30 = CAP0402: as C1 on sheet FPGA; Height: 0.5mm; MSL: MSL 1; Package: =Footprint; RoHS: Comply; Weight: 1.500mg; PartType: CHIP CERAMIC CAPACITOR; Pins: 2; BOMDescription: =MntType+' '+PartType+' '+Package+' '+Value+' '+Tolerance+' '+Voltage+' '+TempCoeff+' '+MPN; CFootprint: =Footprint; Voltage: 50V; Part Number: CAP0402; ClassName: Capacitor; ComponentLink1Description: Datasheet; ComponentLink1Description: New link; ComponentLink1URL: https://datasheet.lcsc.com/lcsc/1810191222_Samsung-Electro-Mechanics-CL05B104KB54PNC_C307331.pdf
D4 = W25Q128JVSIM: Manufacturer: WINBOND; MntType: SMD; Part Number: W25Q128JVSIM; MSL: MSL 1; Package: SO-8; RoHS: Comply; PartType: Flash; Pins: 8; BOMDescription: W25Q128JVSIM; CFootprint: =Footprint; ClassName: Flash; ComponentLink1Description: Datasheet; ComponentLink1URL: https://www.winbond.com/resource-files/w25q128jv_dtr%20revc%2003272018%20plus.pdf
R25 R26 = RES0402: Manufacturer: UNI-ROYAL; ManufacturerAlt: JLCPCB; MPN: 0402WGF4701TCE; MPNAlt: C25900; MntType: SMD; Notes: Basic Part; TempCoeff: 100ppm/C; Tolerance: 1%; Voltage: 50V; Height: 0.35mm; MSL: MSL 1; Package: =Footprint; Power: 1/16W; RoHS: Comply; PartType: CHIP RESISTOR; Pins: 2; BOMDescription: =MntType+' '+PartType+' '+Package+' '+Value+' '+Tolerance+' '+Voltage+' '+TempCoeff+' '+MPN; CFootprint: =Footprint; Part Number: RES0402; ClassName: Resistor; ComponentLink1Description: Datasheet; ComponentLink1Description: New link; ComponentLink1URL: https://datasheet.lcsc.com/lcsc/1810301132_UNI-ROYAL-Uniroyal-Elec-0402WGF4701TCE_C25900.pdf
R27 = RES0402: as R1 on sheet FPGA; Height: 0.35mm; MSL: MSL 1; Package: =Footprint; Power: 1/16W; RoHS: Comply; PartType: CHIP RESISTOR; Pins: 2; BOMDescription: =MntType+' '+PartType+' '+Package+' '+Value+' '+Tolerance+' '+Voltage+' '+TempCoeff+' '+MPN; CFootprint: =Footprint; Part Number: RES0402; ClassName: Resistor; ComponentLink1Description: Datasheet; ComponentLink1Description: New link; ComponentLink1URL: https://datasheet.lcsc.com/lcsc/1811132311_UNI-ROYAL-Uniroyal-Elec-0402WGF1001TCE_C11702.pdf

## Sheet DAC.SchDoc: Наименование
size 209 x 297 mm; ApprovedBy: Утвердил; CheckedBy: Проверил; Author: Разработал; CompanyName: Организация; DrawnBy: Н.Контр; Engineer: Т.Контр; SheetNumber: 1; SheetTotal: 1; PageSetup: Record=PageOptions|CenterHorizontal=True|CenterVertical=True|PrintScale=0.94|XCorrection=1.00|YCorrection=1.00|PrintKind=1|BorderSize=5000000|LeftOffset=0|BottomOffset=0|Orientation=1|PaperLength=1000|PaperWidth=1000|Scale=100|PaperSource=7|PrintQuality=-4|MediaType=1|DitherType=10|PaperKind=A4|PrintScaleMode=1; DecimalNumber: DAC; HeadOfSector: Нач. сектора; MainDevice: Перв.примен.; Name: Наименование; DocumentName: Sheet1.SCHDOC
Used 4 times, as channels A7, A8, A6, A9. Parts and nets are listed once, with the designators drawn on the sheet.
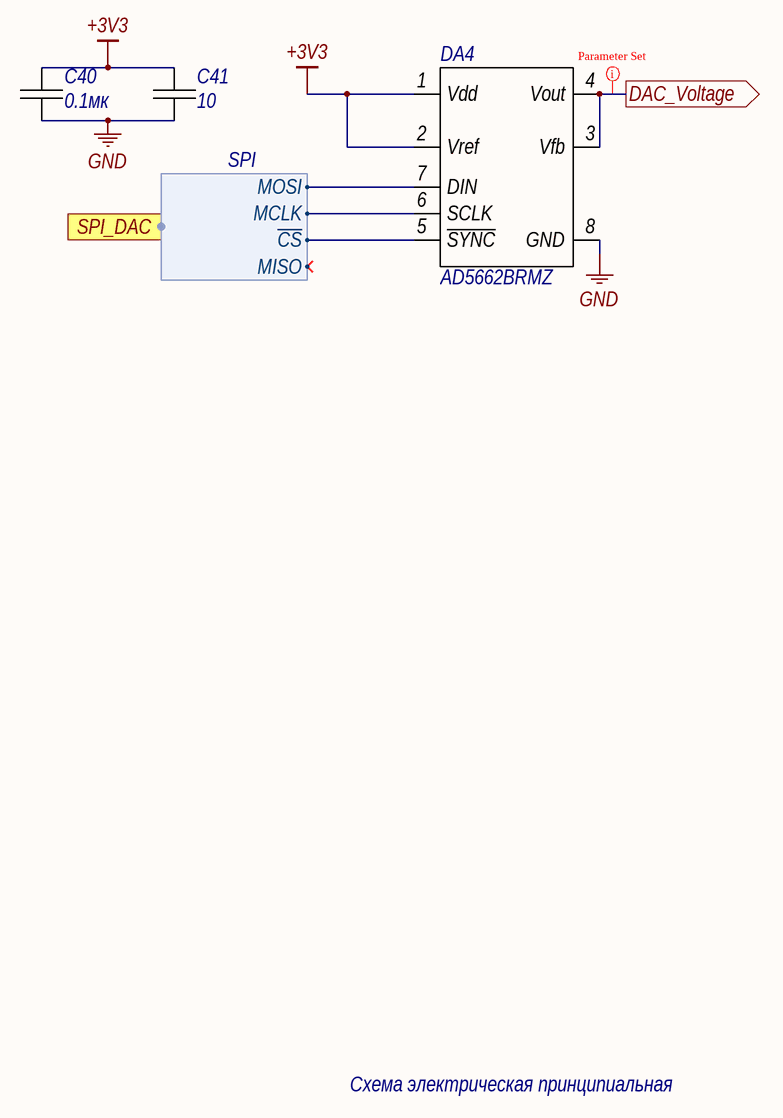
[diagram p3: DAC.SchDoc]

### Parts
C40  value 0.1мк  [CAP0402]  (hidden comment: 0.1мк 50V)
C41  value 10  [CAP0402]  (hidden comment: 10 50V)
DA4  AD5662BRMZ  [TSOP65P490X110-8N]

### Ports
DAC_Voltage (out), SPI_DAC (harness SPI)

### Harnesses
SPI: ~{CS}, MCLK, MISO, MOSI

### Nets
+3V3: C40.2 C41.2 DA4.1(Vdd) DA4.2(Vref)
GND: C40.1 C41.1 DA4.8(GND)
DAC_Voltage: DA4.3(Vfb) DA4.4(Vout) ; port DAC_Voltage
NetDA4_5: DA4.5(~{SYNC}) ; port SPI_DAC.~{CS}
NetDA4_6: DA4.6(SCLK) ; port SPI_DAC.MCLK
NetDA4_7: DA4.7(DIN) ; port SPI_DAC.MOSI

### Channels
A7: designators C40=A7.C40 C41=A7.C41 DA4=A7.DA4; ports DAC_Voltage=NetA7.DA4_3
A8: designators C40=A8.C40 C41=A8.C41 DA4=A8.DA4; ports DAC_Voltage=NetA8.DA4_3
A6: designators C40=A6.C40 C41=A6.C41 DA4=A6.DA4; ports DAC_Voltage=NetA6.DA4_3
A9: designators C40=A9.C40 C41=A9.C41 DA4=A9.DA4; ports DAC_Voltage=NetA9.DA4_3

### Layout directives
net class Signal: NetA7.DA4_3

### Notes on the sheet
- Схема электрическая принципиальная
- Подп. и дата
- Инв.№ дубл.
- Взам.инв.№
- Подп.и дата
- Инв.№ подл.
- Изм.
- Лист
- № докум.
- Подп.
- Дата
- Формат  A4

### Library data of the parts
C40 = CAP0402: as C1 on sheet FPGA; Height: 0.5mm; MSL: MSL 1; Package: =Footprint; RoHS: Comply; Weight: 1.500mg; PartType: CHIP CERAMIC CAPACITOR; Pins: 2; BOMDescription: =MntType+' '+PartType+' '+Package+' '+Value+' '+Tolerance+' '+Voltage+' '+TempCoeff+' '+MPN; CFootprint: =Footprint; Voltage: 50V; Part Number: CAP0402; ClassName: Capacitor; ComponentLink1Description: Datasheet; ComponentLink1Description: New link; ComponentLink1URL: https://datasheet.lcsc.com/lcsc/1810191222_Samsung-Electro-Mechanics-CL05B104KB54PNC_C307331.pdf
C41 = CAP0402: Manufacturer: Samsung Electro-Mechanics; ManufacturerAlt: JLCPCB; MPN: CL05C100JB5NNNC; MPNAlt: C32949; MntType: SMD; MSL: MSL 1; Package: =Footprint; RoHS: Comply; PartType: CHIP CERAMIC CAPACITOR; Pins: 2; BOMDescription: =MntType+' '+PartType+' '+Package+' '+Value+' '+Tolerance+' '+Voltage+' '+TempCoeff+' '+MPN; CFootprint: =Footprint; Voltage: 50V; Part Number: CAP0402; ClassName: Capacitor; ComponentLink1Description: Datasheet
DA4 = AD5662: Manufacturer: Analog Devices; Value: AD5662; MntType: SMD; MPN: AD5662BRMZ; Part Number: AD5662; MSL: MSL 1; Package: MSOP-8; RoHS: Comply; PartType: DAC; Pins: 8; BOMDescription: =MntType+' '+PartType+' '+Package+' '+Value+' '+Tolerance+' '+Voltage+' '+TempCoeff+' '+MPN; CFootprint: =Footprint; ClassName: DAC; ComponentLink1Description: Datasheet; ComponentLink1URL: https://www.analog.com/media/en/technical-documentation/data-sheets/AD5662.pdf

## Sheet FTDI.SchDoc: Наименование
size 420 x 297 mm; ApprovedBy: Утвердил; CheckedBy: Проверил; Author: Михайловский; CompanyName: Организация; DrawnBy: Н.Контр; Engineer: Т.Контр; SheetNumber: 1; SheetTotal: 1; PageSetup: Record=PageOptions|CenterHorizontal=True|CenterVertical=True|PrintScale=0.94|XCorrection=1.00|YCorrection=1.00|PrintKind=1|BorderSize=5000000|LeftOffset=0|BottomOffset=0|Orientation=1|PaperLength=1000|PaperWidth=1000|Scale=100|PaperSource=7|PrintQuality=-4|MediaType=1|DitherType=10|PaperKind=A4|PrintScaleMode=1; DecimalNumber: FTDI; HeadOfSector: Нач. сектора; MainDevice: Перв.примен.; Name: Наименование; DocumentName: Sheet1.SCHDOC
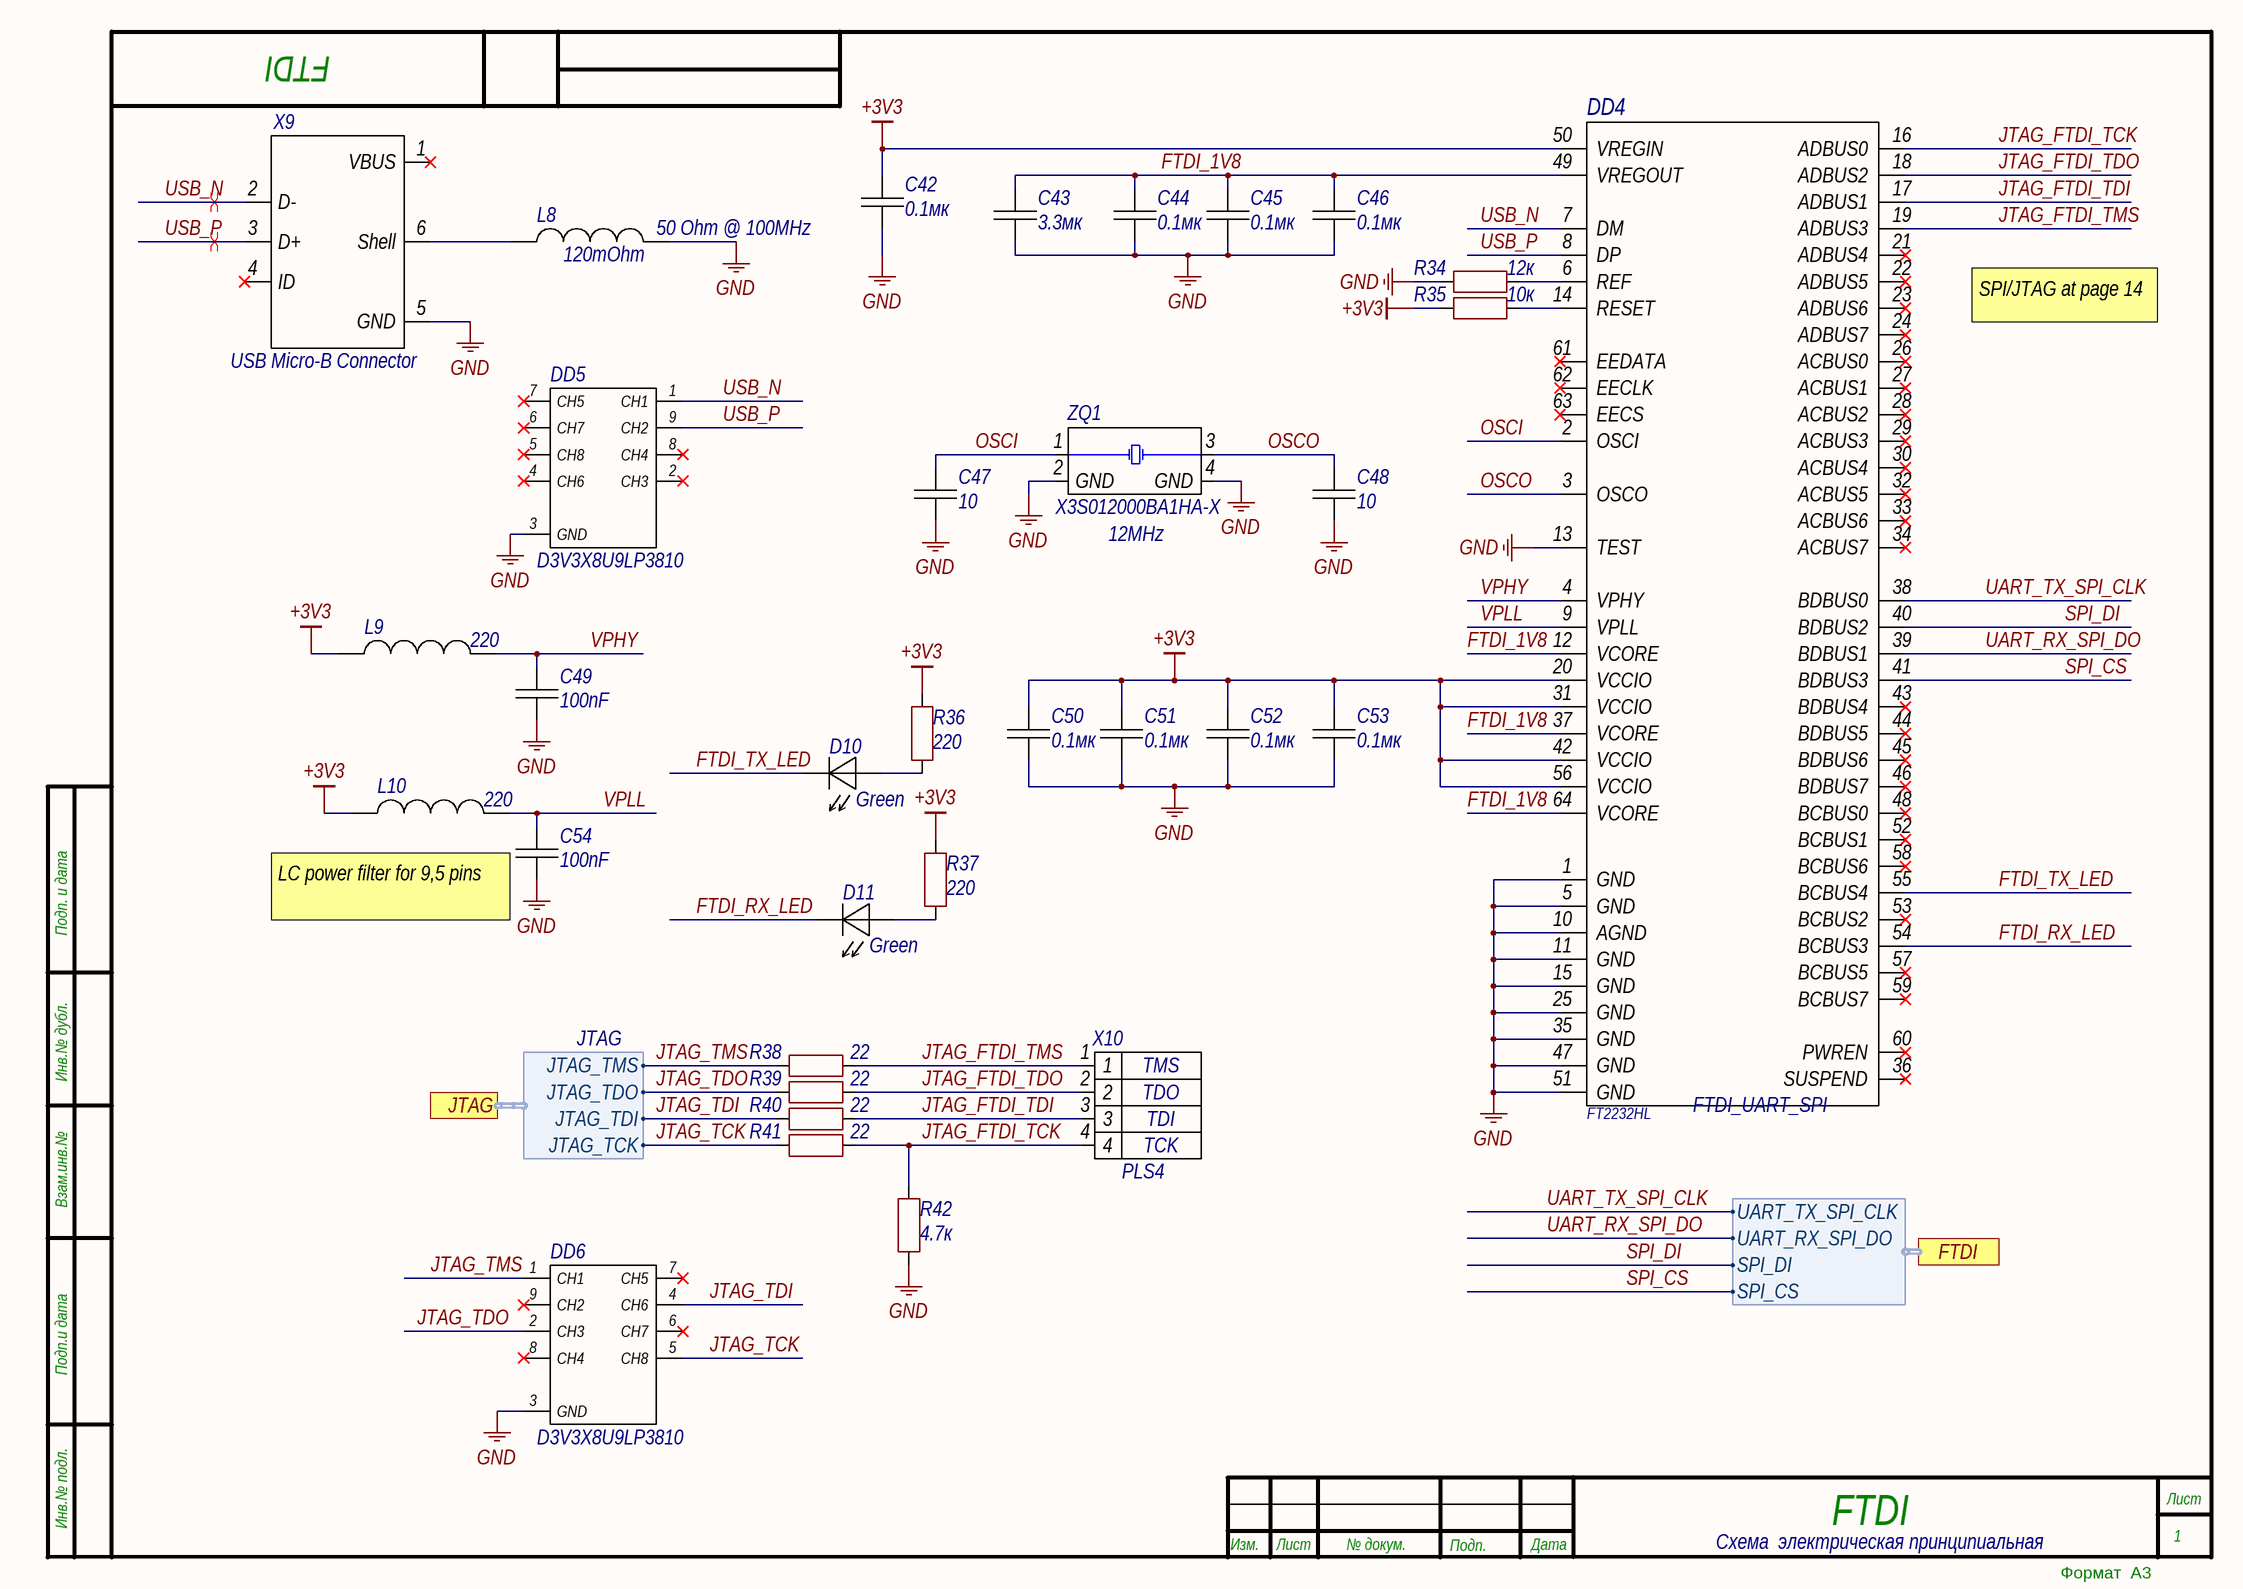
[diagram p4: FTDI.SchDoc]

### Parts
C42  value 0.1мк  [CAP0402]  (hidden comment: 0.1мк 50V)
C43  value 3.3мк  [CAP0402]  (hidden comment: 3.3мк 6.3V)
C44  value 0.1мк  [CAP0402]  (hidden comment: 0.1мк 50V)
C45  value 0.1мк  [CAP0402]  (hidden comment: 0.1мк 50V)
C46  value 0.1мк  [CAP0402]  (hidden comment: 0.1мк 50V)
C47  value 10  [CAP0402]  (hidden comment: 10 50V)
C48  value 10  [CAP0402]  (hidden comment: 10 50V)
C49  value 100nF  [CAP0402]  (hidden comment: 100nF 50V)
C50  value 0.1мк  [CAP0402]  (hidden comment: 0.1мк 50V)
C51  value 0.1мк  [CAP0402]  (hidden comment: 0.1мк 50V)
C52  value 0.1мк  [CAP0402]  (hidden comment: 0.1мк 50V)
C53  value 0.1мк  [CAP0402]  (hidden comment: 0.1мк 50V)
C54  value 100nF  [CAP0402]  (hidden comment: 100nF 50V)
D10  Green  [LED603]
D11  Green  [LED603]
DD4  MPN: FT2232HL  [LQFP64]
DD5  MPN: D3V3X8U9LP3810  [U-DFN3810-9]  (hidden comment: TVS at USB diff pair)
DD6  MPN: D3V3X8U9LP3810  [U-DFN3810-9]  (hidden comment: TVS Diode at JTAG)
L8  DCResistance: 120mOhm  [CAPC0603N]  (hidden comment: 50 Ohm @ 100MHz)
L9  220  [CAPC0603N]
L10  220  [CAPC0603N]
R34  12к  [RESC0402(1005)_M]
R35  10к  [RESC0402(1005)_M]
R36  220  [RESC0402(1005)_M]
R37  220  [RESC0402(1005)_M]
R38  value 22  [RESC0402(1005)_M]  (hidden comment: 22 1/16W)
R39  value 22  [RESC0402(1005)_M]  (hidden comment: 22 1/16W)
R40  value 22  [RESC0402(1005)_M]  (hidden comment: 22 1/16W)
R41  value 22  [RESC0402(1005)_M]  (hidden comment: 22 1/16W)
R42  value 4.7к  [RESC0402(1005)_M]  (hidden comment: 4.7к 1/16W)
X9  USB Micro-B Connector  [AMPHENOL_10118194-0001LF]
X10  Wire1: TMS  Wire2: TDO  Wire3: TDI  Wire4: TCK  [PLS4]  (hidden comment: PLS4)
ZQ1  MPN: X3S012000BA1HA-X  [TSX-3225_V]  (hidden comment: 12MHz)

### Ports
FTDI (harness FTDI_UART_SPI), JTAG (harness JTAG)

### Harnesses
JTAG: JTAG_TCK, JTAG_TDI, JTAG_TDO, JTAG_TMS
FTDI_UART_SPI: UART_TX_SPI_CLK, UART_RX_SPI_DO, SPI_DI, SPI_CS

### Nets
+3V3: C42.1 C50.2 C51.2 C52.2 C53.2 DD4.20(VCCIO) DD4.31(VCCIO) DD4.42(VCCIO) DD4.50(VREGIN) DD4.56(VCCIO) L9.1 L10.1 R35.2 R36.2 R37.2
GND: C42.2 C43.1 C44.2 C45.2 C46.2 C47.1 C48.1 C49.1 C50.1 C51.1 C52.1 C53.1 C54.1 DD4.1(GND) DD4.5(GND) DD4.10(AGND) DD4.11(GND) DD4.13(TEST) DD4.15(GND) DD4.25(GND) DD4.35(GND) DD4.47(GND) DD4.51(GND) DD5.3(GND) DD6.3(GND) L8.2 R34.2 R42.2 X9.5(GND) ZQ1.2(GND) ZQ1.4(GND)
FTDI_1V8: C43.2 C44.1 C45.1 C46.1 DD4.12(VCORE) DD4.37(VCORE) DD4.49(VREGOUT) DD4.64(VCORE)
FTDI_RX_LED: D11.1(A) DD4.54(BCBUS3)
FTDI_TX_LED: D10.1(A) DD4.55(BCBUS4)
JTAG_FTDI_TCK: DD4.16(ADBUS0) R41.2 R42.1 X10.4
JTAG_FTDI_TDI: DD4.17(ADBUS1) R40.2 X10.3
JTAG_FTDI_TDO: DD4.18(ADBUS2) R39.2 X10.2
JTAG_FTDI_TMS: DD4.19(ADBUS3) R38.2 X10.1
JTAG_TCK: DD6.5(CH8) R41.1 ; port JTAG.JTAG_TCK
JTAG_TDI: DD6.4(CH6) R40.1 ; port JTAG.JTAG_TDI
JTAG_TDO: DD6.2(CH3) R39.1 ; port JTAG.JTAG_TDO
JTAG_TMS: DD6.1(CH1) R38.1 ; port JTAG.JTAG_TMS
OSCI: C47.2 DD4.2(OSCI) ZQ1.1(X1)
OSCO: C48.2 DD4.3(OSCO) ZQ1.3(X2)
SPI_CS: DD4.41(BDBUS3) ; port FTDI.SPI_CS
SPI_DI: DD4.40(BDBUS2) ; port FTDI.SPI_DI
UART_RX_SPI_DO: DD4.39(BDBUS1) ; port FTDI.UART_RX_SPI_DO
UART_TX_SPI_CLK: DD4.38(BDBUS0) ; port FTDI.UART_TX_SPI_CLK
USB_N: DD4.7(DM) DD5.1(CH1) X9.2(D-)
USB_P: DD4.8(DP) DD5.9(CH2) X9.3(D+)
VPHY: C49.2 DD4.4(VPHY) L9.2
VPLL: C54.2 DD4.9(VPLL) L10.2
NetD10_2: D10.2(K) R36.1
NetD11_2: D11.2(K) R37.1
NetDD4_6: DD4.6(REF) R34.1
NetDD4_14: DD4.14(RESET) R35.1
NetL8_1: L8.1 X9.6(Shell)

Not connected (* = marked no-connect by the designer): DD4 21(ADBUS4)* 22(ADBUS5)* 23(ADBUS6)* 24(ADBUS7)* 26(ACBUS0)* 27(ACBUS1)* 28(ACBUS2)* 29(ACBUS3)* 30(ACBUS4)* 32(ACBUS5)* 33(ACBUS6)* 34(ACBUS7)* 36(SUSPEND)* 43(BDBUS4)* 44(BDBUS5)* 45(BDBUS6)* 46(BDBUS7)* 48(BCBUS0)* 52(BCBUS1)* 53(BCBUS2)* 57(BCBUS5)* 58(BCBUS6)* 59(BCBUS7)* 60(PWREN)* 61(EEDATA)* 62(EECLK)* 63(EECS)*; DD5 2(CH3)* 4(CH6)* 5(CH8)* 6(CH7)* 7(CH5)* 8(CH4)*; DD6 6(CH7)* 7(CH5)* 8(CH4)* 9(CH2)*; X9 1(VBUS)* 4(ID)*

### Layout directives
differential pair; differential pair class USB: USB_N, USB_P

### Notes on the sheet
- SPI/JTAG at page 14
- LC power filter for 9,5 pins
- Схема  электрическая принципиальная
- Подп. и дата
- Инв.№ дубл.
- Взам.инв.№
- Подп.и дата
- Инв.№ подл.
- Изм.
- Лист
- № докум.
- Подп.
- Дата
- Формат  A3

### Library data of the parts
C42 C44-C46 C49-C54 = CAP0402: as C1 on sheet FPGA; Height: 0.5mm; MSL: MSL 1; Package: =Footprint; RoHS: Comply; Weight: 1.500mg; PartType: CHIP CERAMIC CAPACITOR; Pins: 2; BOMDescription: =MntType+' '+PartType+' '+Package+' '+Value+' '+Tolerance+' '+Voltage+' '+TempCoeff+' '+MPN; CFootprint: =Footprint; Voltage: 50V; Part Number: CAP0402; ClassName: Capacitor; ComponentLink1Description: Datasheet; ComponentLink1Description: New link; ComponentLink1URL: https://datasheet.lcsc.com/lcsc/1810191222_Samsung-Electro-Mechanics-CL05B104KB54PNC_C307331.pdf
C43 = CAP0402: Manufacturer: TDK; ManufacturerAlt: JLCPCB; MPN: C1005X5R0J335MTJ00E; MPNAlt: C694161; MntType: SMD; MSL: MSL 1; Package: =Footprint; RoHS: Comply; PartType: CHIP CERAMIC CAPACITOR; Pins: 2; BOMDescription: =MntType+' '+PartType+' '+Package+' '+Value+' '+Tolerance+' '+Voltage+' '+TempCoeff+' '+MPN; CFootprint: =Footprint; Voltage: 6.3V; Part Number: CAP0402; ClassName: Capacitor; ComponentLink1Description: Datasheet
C47 C48 = CAP0402: as C41 on sheet DAC; MSL: MSL 1; Package: =Footprint; RoHS: Comply; PartType: CHIP CERAMIC CAPACITOR; Pins: 2; BOMDescription: =MntType+' '+PartType+' '+Package+' '+Value+' '+Tolerance+' '+Voltage+' '+TempCoeff+' '+MPN; CFootprint: =Footprint; Voltage: 50V; Part Number: CAP0402; ClassName: Capacitor; ComponentLink1Description: Datasheet
D10 D11 = LEDC: as D2 on sheet FPGA; MSL: MSL 5; Package: =Footprint; RoHS: Comply; PartType: CHIP LED; Pins: 2; BOMDescription: =MntType+' '+PartType+' '+Package+' '+Value+' '+Tolerance+' '+Voltage+' '+TempCoeff+' '+MPN; CFootprint: =Footprint; Value: Green; Part Number: LEDC; ClassName: LED; ComponentLink1Description: Datasheet
DD4 = FT2232HL: Manufacturer: FTDI; MntType: SMD; Part Number: FT2232HL; MSL: MSL 1; Package: LQFP64; RoHS: Comply; PartType: FTDI; Pins: 64; BOMDescription: FT2232HL; CFootprint: =Footprint; ClassName: FTDI; ComponentLink1Description: Datasheet; ComponentLink1URL: https://ftdichip.com/wp-content/uploads/2020/07/DS_FT2232H.pdf
DD5 = D3V3X8U9LP3810: Manufacturer: DiodesInc; ManufacturerAlt: JLCPCB; MPNAlt: C1973794; MntType: SMD; Part Number: D3V3X8U9LP3810; MSL: MSL 1; Package: =Footprint; RoHS: Comply; PartType: TVS; Pins: 9; BOMDescription: D3V3X8U9LP3810; CFootprint: =Footprint; ClassName: TVS; ComponentLink1Description: Datasheet; ComponentLink1URL: https://www.elitan.ru/pdf/1/1/5/3/0/11530248.pdf
DD6 = D3V3X8U9LP3810: Manufacturer: DiodesInc; MntType: SMD; Part Number: D3V3X8U9LP3810; MSL: MSL 1; Package: =Footprint; RoHS: Comply; PartType: TVS; Pins: 9; BOMDescription: D3V3X8U9LP3810; CFootprint: =Footprint; ClassName: TVS; ComponentLink1Description: Datasheet; ComponentLink1URL: https://www.diodes.com/assets/Datasheets/D3V3X8U9LP3810.pdf
L8 = Inductor_SMD: Manufacturer: FH(Guangdong Fenghua Advanced Tech); ManufacturerAlt: JLCPCB; MPN: CBW160808U500T; MPNAlt: C394476; MntType: SMD; MSL: MSL 1; Package: =Footprint; RoHS: Comply; PartType: INDUCTOR; Pins: 2; BOMDescription: =MntType+' '+PartType+' '+Package+' '+Value+' '+Tolerance+' '+Voltage+' '+TempCoeff+' '+MPN; CFootprint: =Footprint; Value: 50 Ohm @ 100MHz; Part Number: Inductor_SMD; ClassName: Inductor; ComponentLink1Description: Datasheet; ComponentLink1Description: New link; ComponentLink1URL: https://datasheet.lcsc.com/lcsc/1912111437_FH-Guangdong-Fenghua-Advanced-Tech-CBW160808U500T_C394476.pdf
L9 L10 = BLM18KG221SN1D: Manufacturer: Murata; ManufacturerAlt: JLCPCB; MPNAlt: C88980; MntType: SMD; Tolerance: 25%; MPN: BLM18KG221SN1D; Height: 0.6mm; MSL: MSL 1; Package: =Footprint; RoHS: Comply; Weight: 35mg; PartType: Ferrite Beads; Pins: 2; BOMDescription: =MntType+' '+PartType+' '+Package+' '+Value+' '+Tolerance+' '+Voltage+' '+TempCoeff+' '+MPN; CFootprint: =Footprint; Value: 220; Part Number: BLM18KG221SN1D; ClassName: Ferrite Beads; ComponentLink1Description: Datasheet; ComponentLink1URL: https://ru.mouser.com/datasheet/2/281/ENFA0003-1915778.pdf
R34 = RES0402: Manufacturer: UNI-ROYAL(Uniroyal Elec); ManufacturerAlt: JLCPCB; MPN: 0402WGF1202TCE; MPNAlt: C25752; MntType: SMD; MSL: MSL 1; Package: =Footprint; RoHS: Comply; PartType: CHIP RESISTOR; Pins: 2; BOMDescription: =MntType+' '+PartType+' '+Package+' '+Value+' '+Tolerance+' '+Voltage+' '+TempCoeff+' '+MPN; CFootprint: =Footprint; Value: 12к; Part Number: RES0402; ClassName: Resistor; ComponentLink1Description: Datasheet
R35 = RES0402: Manufacturer: UNI-ROYAL(Uniroyal Elec); ManufacturerAlt: JLCPCB; MPN: 0402WGF1002TCE; MPNAlt: C25744; MntType: SMD; MSL: MSL 1; Package: =Footprint; RoHS: Comply; PartType: CHIP RESISTOR; Pins: 2; BOMDescription: =MntType+' '+PartType+' '+Package+' '+Value+' '+Tolerance+' '+Voltage+' '+TempCoeff+' '+MPN; CFootprint: =Footprint; Value: 10к; Part Number: RES0402; ClassName: Resistor; ComponentLink1Description: Datasheet
R36 R37 = RES0402: Manufacturer: UNI-ROYAL(Uniroyal Elec); ManufacturerAlt: JLCPCB; MPN: 0402WGF2200TCE; MPNAlt: C25091; MntType: SMD; MSL: MSL 1; Package: =Footprint; RoHS: Comply; PartType: CHIP RESISTOR; Pins: 2; BOMDescription: =MntType+' '+PartType+' '+Package+' '+Value+' '+Tolerance+' '+Voltage+' '+TempCoeff+' '+MPN; CFootprint: =Footprint; Value: 220; Part Number: RES0402; ClassName: Resistor; ComponentLink1Description: Datasheet
R38-R41 = RES0402: Manufacturer: UNI-ROYAL; ManufacturerAlt: JLCPCB; MPN: 0402WGF220JTCE; MPNAlt: C25092; MntType: SMD; Notes: Basic Part; TempCoeff: 200ppm/C; Tolerance: 1%; Voltage: 50V; Height: 0.35mm; MSL: MSL 1; Package: =Footprint; Power: 1/16W; RoHS: Comply; PartType: CHIP RESISTOR; Pins: 2; BOMDescription: =MntType+' '+PartType+' '+Package+' '+Value+' '+Tolerance+' '+Voltage+' '+TempCoeff+' '+MPN; CFootprint: =Footprint; Part Number: RES0402; ClassName: Resistor; ComponentLink1Description: Datasheet; ComponentLink1Description: New link; ComponentLink1URL: https://datasheet.lcsc.com/lcsc/1811011231_UNI-ROYAL-Uniroyal-Elec-0402WGF220JTCE_C25092.pdf
R42 = RES0402: as R25 on sheet FLASH; Height: 0.35mm; MSL: MSL 1; Package: =Footprint; Power: 1/16W; RoHS: Comply; PartType: CHIP RESISTOR; Pins: 2; BOMDescription: =MntType+' '+PartType+' '+Package+' '+Value+' '+Tolerance+' '+Voltage+' '+TempCoeff+' '+MPN; CFootprint: =Footprint; Part Number: RES0402; ClassName: Resistor; ComponentLink1Description: Datasheet; ComponentLink1Description: New link; ComponentLink1URL: https://datasheet.lcsc.com/lcsc/1810301132_UNI-ROYAL-Uniroyal-Elec-0402WGF4701TCE_C25900.pdf
X9 = 10118194-0001LF: USB 2.0 Micro-B Female Connector; Manufacturer: Amphenol; ManufacturerAlt: JLCPCB; MPNAlt: C132563; MntType: SMD/TH; Value: USB Micro-B Connector; Part Number: 10118194-0001LF; MPN: 10118194-0001LF; MSL: MSL 1; Package: =Footprint; RoHS: Comply; PartType: CONNECTOR; Pins: 6; BOMDescription: =MntType+' '+PartType+' '+Package+' '+Value+' '+Tolerance+' '+Voltage+' '+TempCoeff+' '+MPN; CFootprint: =Footprint; ClassName: Connector; System: Connector; ComponentLink1Description: Datasheet; ComponentLink1URL: https://cdn.amphenol-icc.com/media/wysiwyg/files/drawing/10118194.pdf
X10 = PLS4: JTAG Header; MntType: DIP; BOMDescription: DIP CONNECTOR CONNPLS4     PLS4; System: Connector; MPN: PLS4; MSL: MSL 1; Package: CONNPLS4; RoHS: Comply; PartType: CONNECTOR; Pins: 4; CFootprint: =Footprint; Part Number: PLS4; ClassName: Connector; ComponentLink1Description: Datasheet
ZQ1 = X3S012000BA1HA-X: Manufacturer: HELE(HARMONY ELEC); MntType: SMD; Part Number: X3S012000BA1HA-X; Value: 12MHz; MSL: MSL 1; Package: SMD3225; RoHS: Comply; PartType: CRYSTAL; Pins: 4; BOMDescription: X3S012000BA1HA-X; CFootprint: =Footprint; ClassName: CRYSTAL; ComponentLink1Description: Datasheet; ComponentLink1URL: https://datasheet.lcsc.com/lcsc/1811121833_HELE-Harmony-Elec-X3S012000BA1HA-X_C254364.pdf